# Altium project component_tester.PrjPcb
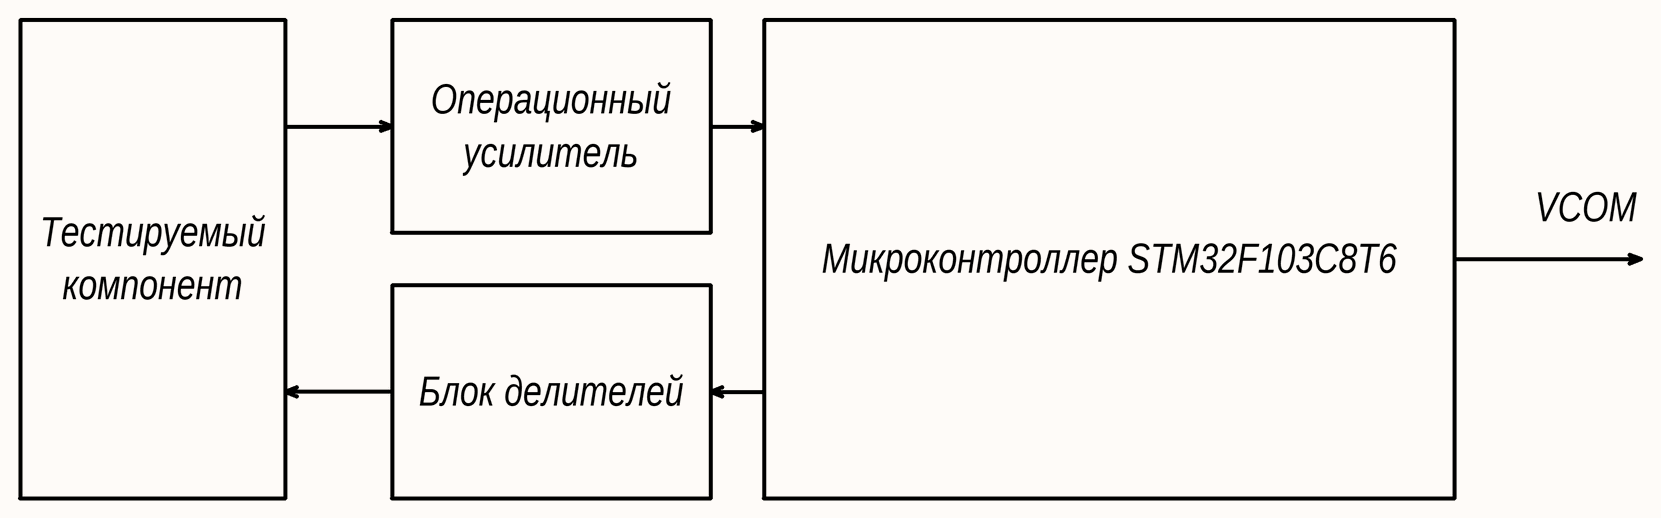
[diagram p0: E1.SchDoc]
FirstReferrence: ИУ4.11.03.03.25.06.62.14.001; Title2str: микроконтроллера STM32F103C8T6; Title: Тестер компонентов на базе; decimal: ИУ4.11.03.03.25.06.62.14.001; CheckedBy: Чистяков М. Г.; Author: Наумов И. К.
4 sheets, 47 parts. Net scope: global (net labels, ports and power ports of the same name join across sheets).
Board file: PCB.PcbDoc
Sheets:
  E1.SchDoc
  E2.SchDoc
  E3.SchDoc
  Stend.SchDoc

## Sheet E1.SchDoc: Тестер компонентов на базе
size 420 x 297 mm; CheckedBy: Чистяков М. Г.; Author: Наумов И. К.; DocumentNumber: ИУ4.11.03.03.25.06.62.14.001 Э1; SheetNumber: 1; SheetTotal: 3; DocumentType: Схема электрическая структурная; FirstReferrence: ИУ4.11.03.03.25.06.62.14.001

### Notes on the sheet
- Операционный
- усилитель
- Тестируемый
- VCOM
- компонент
- Микроконтроллер STM32F103C8T6
- Блок делителей
- Перв. примен.
- Справ. №
- Подп. и дата
- Инв. № дубл.
- Взам. инв. №
- Разраб.
- Изм.
- Лист
- № докум.
- Подп.
- Дата
- Лит.
- Масса
- Масштаб
- Пров.
- Т.контр.
- Листов
- 1
- Инв. № подл.
- Утв.
- Н.контр.
- Кафедра ИУ4
- МГТУ им. Н. Э. Баумана
- 2.106-A3
- Копировал
- Формат А3
- Группа ИУ4-62Б

## Sheet E2.SchDoc: Тестер компонентов на базе
size 420 x 297 mm; DocumentNumber: ИУ4.11.03.03.25.06.62.14.001 Э2; SheetNumber: 2; SheetTotal: 3; DocumentType: Схема электрическая функциональная; FirstReferrence: ИУ4.11.03.03.25.06.62.14.001
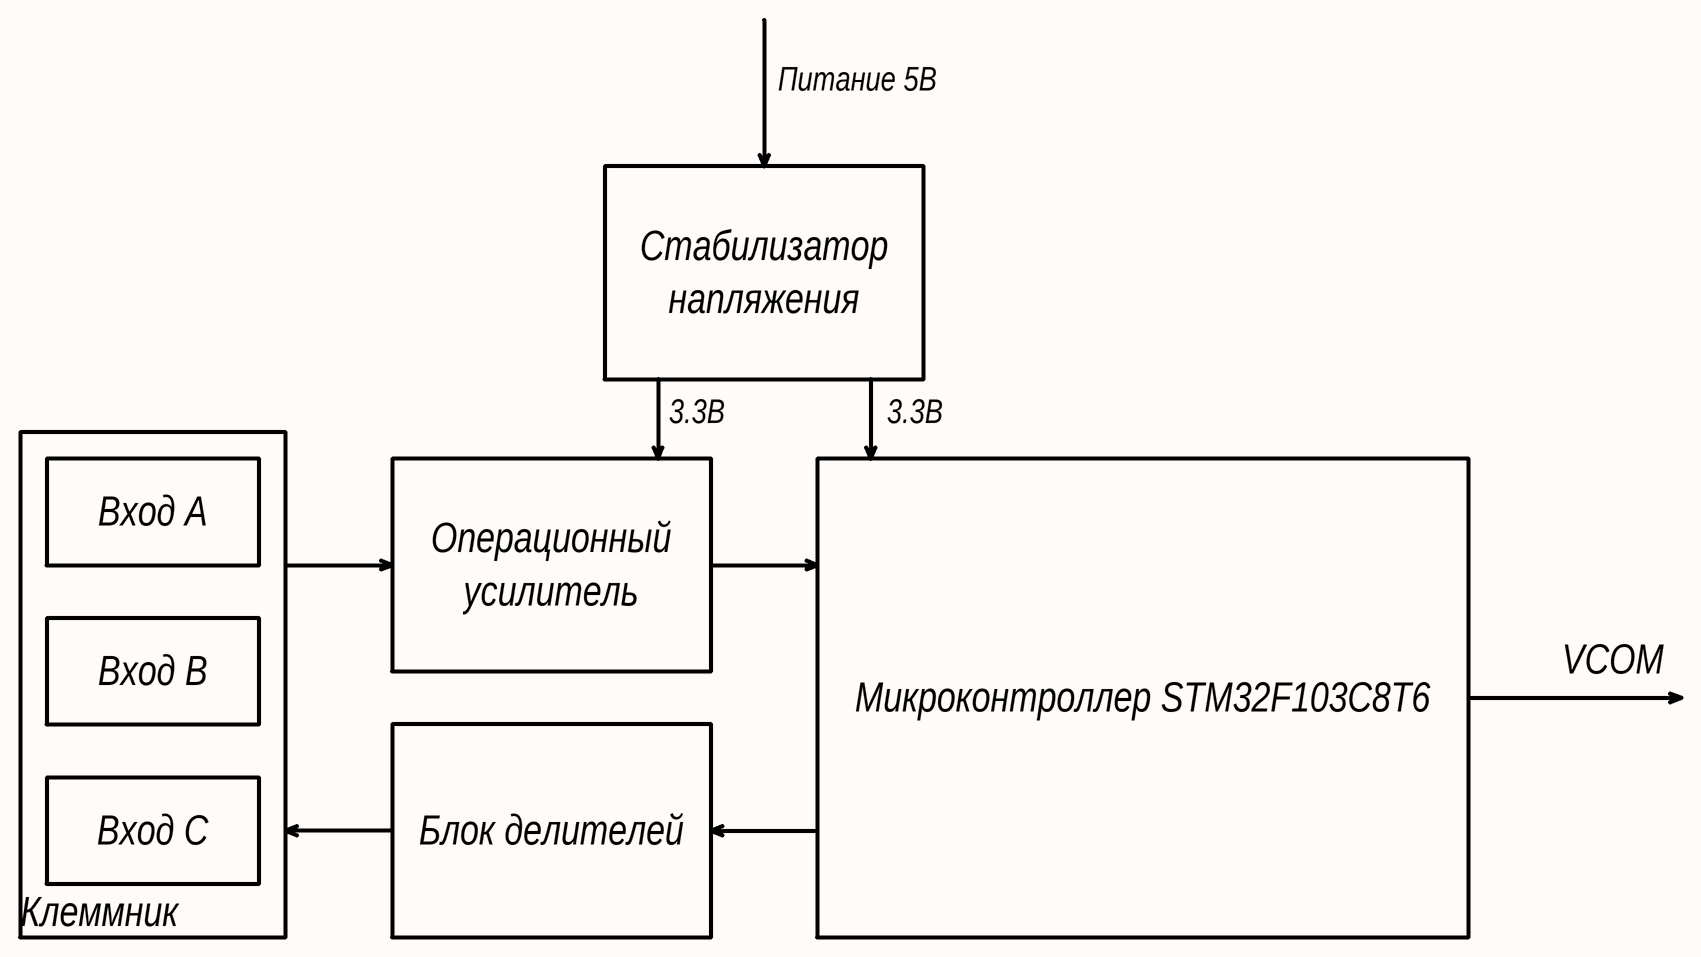
[diagram p1: E2.SchDoc]

### Notes on the sheet
- Питание 5В
- Стабилизатор
- напляжения
- 3.3В
- Вход A
- Операционный
- усилитель
- Вход B
- Микроконтроллер STM32F103C8T6
- VCOM
- Вход C
- Блок делителей
- Клеммник
- Перв. примен.
- Справ. №
- Подп. и дата
- Инв. № дубл.
- Взам. инв. №
- Разраб.
- Изм.
- Лист
- № докум.
- Подп.
- Дата
- Лит.
- Масса
- Масштаб
- Пров.
- Т.контр.
- Листов
- 1
- Инв. № подл.
- Утв.
- Н.контр.
- Кафедра ИУ4
- МГТУ им. Н. Э. Баумана
- 2.106-A3
- Копировал
- Формат А3
- Группа ИУ4-62Б

## Sheet E3.SchDoc: Тестер компонентов на базе
size 420 x 297 mm; CheckedBy: Чистяков М. Г.; Author: Наумов И. К.; DocumentNumber: ИУ4.11.03.03.25.06.62.14.001 Э3; SheetNumber: 3; SheetTotal: 4; DocumentType: Схема электрическая принципиальная; FirstReferrence: ИУ4.11.03.03.25.06.62.14.001
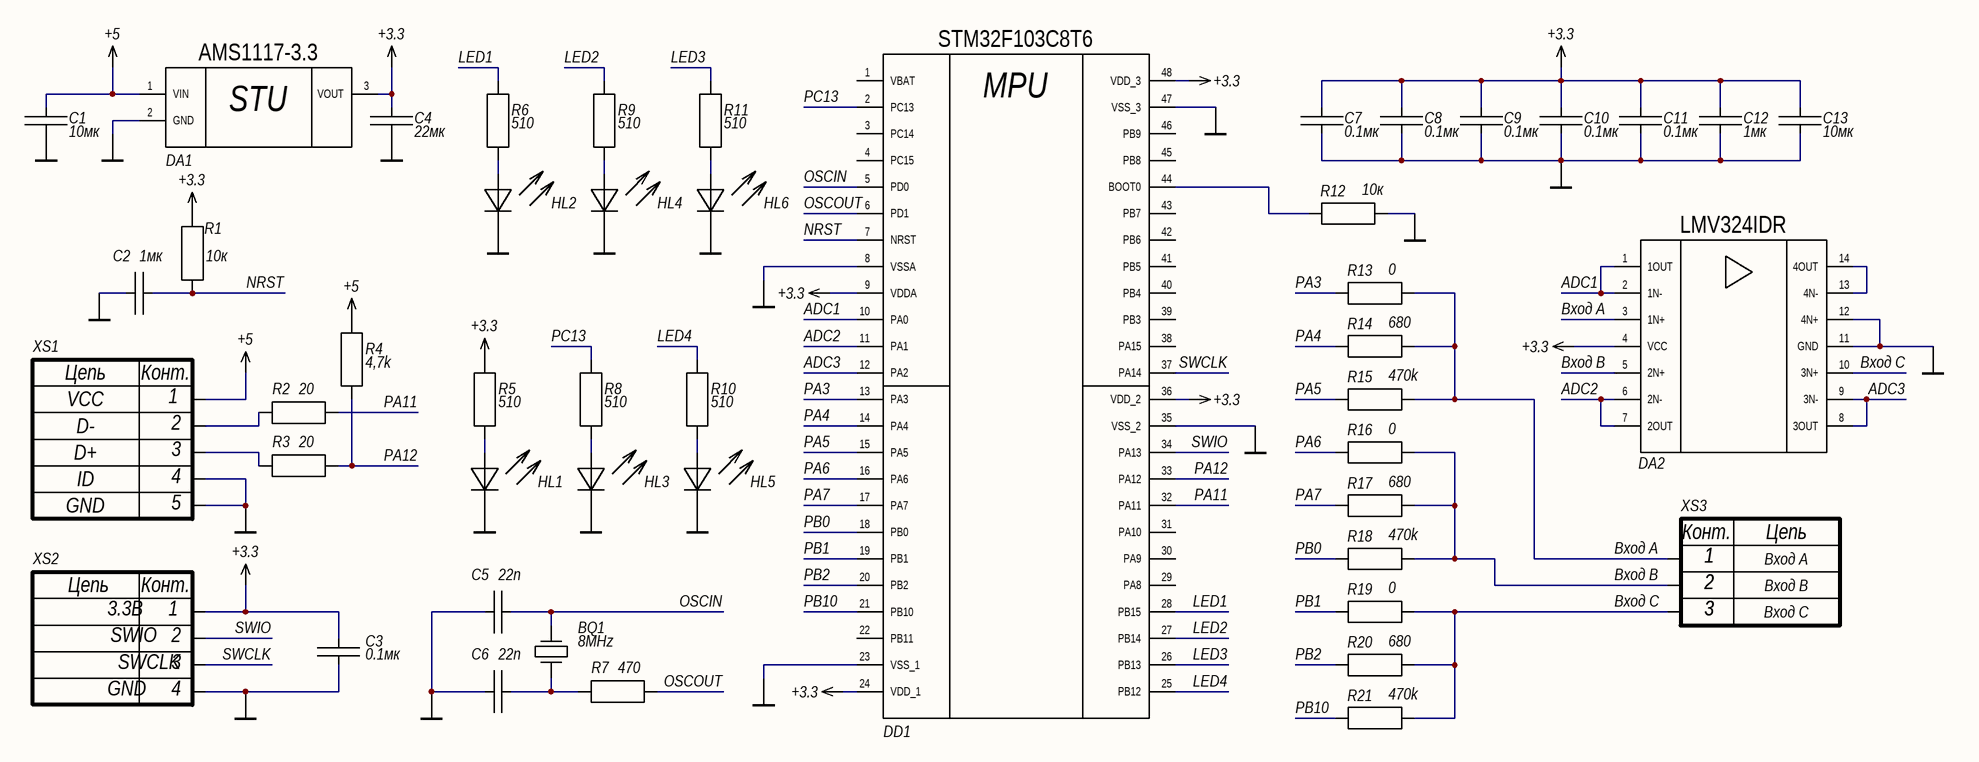
[diagram p2: E3.SchDoc]

### Parts
BQ1  8MHz  [Crystal Resonator]
C1  10мк  [C SMD 0603]
C2  1мк  [C SMD 0603]
C3  0.1мк  [C SMD 0603]
C4  22мк  [C SMD 0603]
C5  22п  [C SMD 0603]
C6  22п  [C SMD 0603]
C7  0.1мк  [C SMD 0603]
C8  0.1мк  [C SMD 0603]
C9  0.1мк  [C SMD 0603]
C10  0.1мк  [C SMD 0603]
C11  0.1мк  [C SMD 0603]
C12  1мк  [C SMD 0603]
C13  10мк  [C SMD 0603]
DA1  Stabilizer  [SOT230P695X180-4N]  (value not drawn)
DA2  OpAmp LM358DR [SOIC-14]  [SOP127P600X175-14N]  (value not drawn)
DD1  STM32F103C8T6 [LQFP-48]  [STM32 [LQFP-48]]  (value not drawn)
HL1  LED  [Led 1206]  (value not drawn)
HL2  LED  [Led 1206]  (value not drawn)
HL3  LED  [Led 1206]  (value not drawn)
HL4  LED  [Led 1206]  (value not drawn)
HL5  LED  [Led 1206]  (value not drawn)
HL6  LED  [Led 1206]  (value not drawn)
R1  10к  [R_SMD_1206]
R2  20  [R_SMD_1206]
R3  20  [R_SMD_1206]
R4  4,7k  [R_SMD_1206]
R5  510  [R_SMD_1206]
R6  510  [R_SMD_1206]
R7  470  [R_SMD_1206]
R8  510  [R_SMD_1206]
R9  510  [R_SMD_1206]
R10  510  [R_SMD_1206]
R11  510  [R_SMD_1206]
R12  10к  [R_SMD_1206]
R13  0  [R_SMD_1206]
R14  680  [R_SMD_1206]
R15  470k  [R_SMD_1206]
R16  0  [R_SMD_1206]
R17  680  [R_SMD_1206]
R18  470k  [R_SMD_1206]
R19  0  [R_SMD_1206]
R20  680  [R_SMD_1206]
R21  470k  [R_SMD_1206]
XS1  USB_B  [USB 2.0 Type B Mini]  (value not drawn)
XS2  SWD  [PLS-4]  (value not drawn)
XS3  XS3  [ZIF 14P socket]  (value not drawn)

### Nets
+3.3: C3.1 C4.1 C7.1 C8.1 C9.1 C10.1 C11.1 C12.1 C13.1 DA1.3(VOUT) DA2.4(VCC) DD1.9(VDDA) DD1.24(VDD_1) DD1.36(VDD_2) DD1.48(VDD_3) R1.1 R5.1 XS2.4(3.3В)
+5: C1.1 DA1.1(VIN) R4.2 XS1.1
GND: C1.2 C2.2 C3.2 C4.2 C5.1 C6.1 C7.2 C8.2 C9.2 C10.2 C11.2 C12.2 C13.2 DA1.2(GND) DA2.11(GND) DA2.12(4N+) DD1.8(VSSA) DD1.23(VSS_1) DD1.35(VSS_2) DD1.47(VSS_3) HL1.1 HL2.1 HL3.1 HL4.1 HL5.1 HL6.1 R12.1 XS1.4 XS1.5 XS2.1(GND)
ADC1: DA2.1(1OUT) DA2.2(1N-) DD1.10(PA0)
ADC2: DA2.6(2N-) DA2.7(2OUT) DD1.11(PA1)
ADC3: DA2.8(3OUT) DA2.9(3N-) DD1.12(PA2)
LED1: DD1.28(PB15) R6.1
LED2: DD1.27(PB14) R9.1
LED3: DD1.26(PB13) R11.1
LED4: DD1.25(PB12) R10.1
NRST: C2.1 DD1.7(NRST) R1.2
OSCIN: BQ1.1 C5.2 DD1.5(PD0)
OSCOUT: DD1.6(PD1) R7.2
PA3: DD1.13(PA3) R13.2
PA4: DD1.14(PA4) R14.2
PA5: DD1.15(PA5) R15.2
PA6: DD1.16(PA6) R16.2
PA7: DD1.17(PA7) R17.2
PA11: DD1.32(PA11) R2.2
PA12: DD1.33(PA12) R3.2 R4.1
PB0: DD1.18(PB0) R18.2
PB1: DD1.19(PB1) R19.2
PB2: DD1.20(PB2) R20.2
PB10: DD1.21(PB10) R21.2
PC13: DD1.2(PC13) R8.1
SWCLK: DD1.37(PA14) XS2.2(SWCLK)
SWIO: DD1.34(PA13) XS2.3(SWIO)
Вход A: DA2.3(1N+) R13.1 R14.1 R15.1 XS3.1
Вход B: DA2.5(2N+) R16.1 R17.1 R18.1 XS3.2
Вход C: DA2.10(3N+) R19.1 R20.1 R21.1 XS3.3
NetBQ1_2: BQ1.2 C6.2 R7.1
NetDA2_13: DA2.13(4N-) DA2.14(4OUT)
NetDD1_44: DD1.44(BOOT0) R12.2
NetHL1_2: HL1.2 R5.2
NetHL2_2: HL2.2 R6.2
NetHL3_2: HL3.2 R8.2
NetHL4_2: HL4.2 R9.2
NetHL5_2: HL5.2 R10.2
NetHL6_2: HL6.2 R11.2
NetR2_1: R2.1 XS1.2
NetR3_1: R3.1 XS1.3

Not connected (* = marked no-connect by the designer): DD1 1(VBAT) 3(PC14) 4(PC15) 22(PB11) 29(PA8) 30(PA9) 31(PA10) 38(PA15) 39(PB3) 40(PB4) 41(PB5) 42(PB6) 43(PB7) 45(PB8) 46(PB9)

### Notes on the sheet
- Вход A
- Вход B
- Вход C
- Перв. примен.
- Справ. №
- Подп. и дата
- Инв. № дубл.
- Взам. инв. №
- Разраб.
- Изм.
- Лист
- № докум.
- Подп.
- Дата
- Лит.
- Масса
- Масштаб
- Пров.
- Т.контр.
- Листов
- 1
- Инв. № подл.
- Утв.
- Н.контр.
- Кафедра ИУ4
- МГТУ им. Н. Э. Баумана
- 2.106-A3
- Копировал
- Формат А3
- Группа ИУ4-62Б
- (in symbol OpAmp LM358DR [SOIC-14]) LMV324IDR
- (in symbol Stabilizer) AMS1117-3.3; STU
- (in symbol STM32F103C8T6 [LQFP-48]) STM32F103C8T6; MPU
- (in symbol USB) Цепь; Конт.; VCC; D-; D+; ID; GND
- (in symbol XS3) Конт.; Цепь
- (in symbol XS_SWD) Цепь; Конт.

### Library data of the parts
BQ1 = Quartz resonator
C1-C13 = C
DD1 = STM32F103C8T6 [LQFP-48]: 32bit MCU ARM Cortex-M3 72MHz
R1-R21 = R
XS1 = USB
XS2 = XS_SWD
XS3 = XS3: ZIF 14P socket

## Sheet Stend.SchDoc: Тестер компонентов на базе
size 420 x 297 mm; Address1: Address1; Address2: Address2; Address3: Address3; Address4: Address4; DocumentNumber: ИУ4.11.03.03.25.06.62.14.003 Э1; SheetNumber: 4; SheetTotal: 4; DocumentType: Структурная схема измерительного стенда; FirstReferrence: ИУ4.11.03.03.25.06.62.14.001
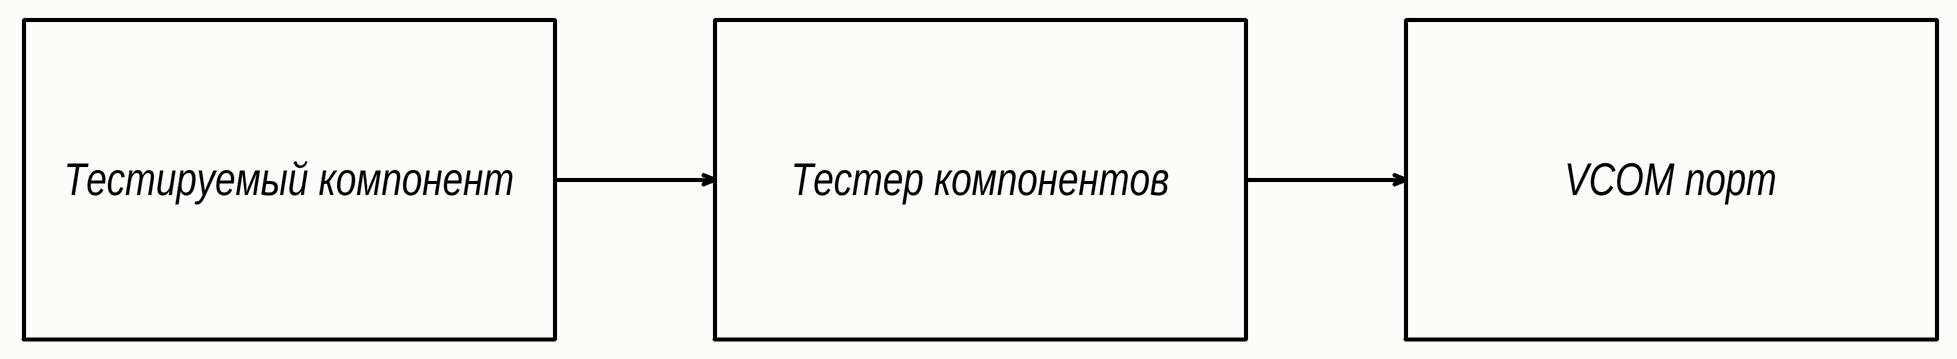
[diagram p3: Stend.SchDoc]

### Notes on the sheet
- Тестируемый компонент
- Тестер компонентов
- VCOM порт
- Перв. примен.
- Справ. №
- Подп. и дата
- Инв. № дубл.
- Взам. инв. №
- Разраб.
- Изм.
- Лист
- № докум.
- Подп.
- Дата
- Лит.
- Масса
- Масштаб
- Пров.
- Т.контр.
- Листов
- 1
- Инв. № подл.
- Утв.
- Н.контр.
- Кафедра ИУ4
- МГТУ им. Н. Э. Баумана
- 2.106-A3
- Копировал
- Формат А3
- Группа ИУ4-62Б